# EAGLE design Europroto2 (EAGLE 9.6.2)
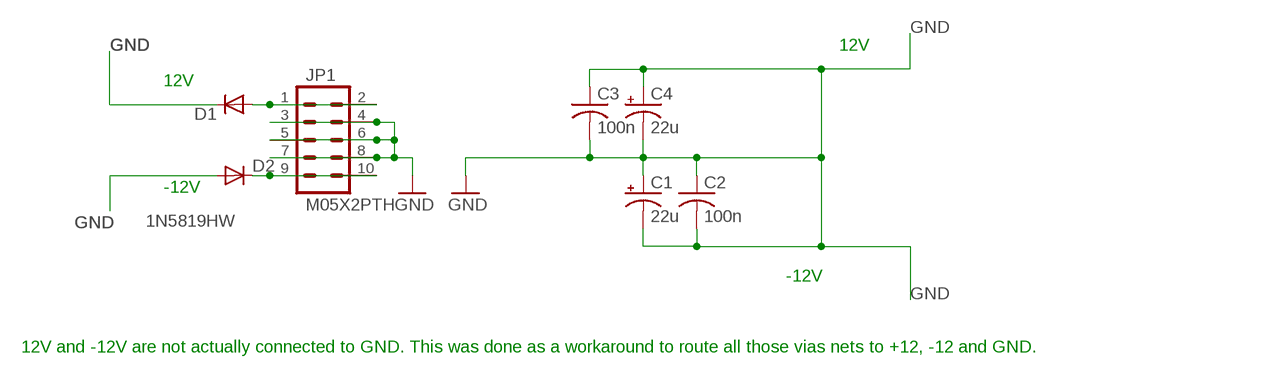
[diagram p0: schematic, sheet 1]

## Parts
C1  22u  CPOL-USB  [PANASONIC_B]
C2  100n  C-USC0603  [C0603]
C3  100n  C-USC0603  [C0603]
C4  22u  CPOL-USB  [PANASONIC_B]
D1  1N5819HW  DIODE-SOD123  [SOD123]
D2  1N5819HW  DIODE-SOD123  [SOD123]
JP1  M05X2PTH  [AVR_ICSP]

## Nets
GND [power]: C1.+ C1.- C2.1 C2.2 C3.1 C3.2 C4.+ C4.- D1.C D2.A JP1.3 JP1.4 JP1.5 JP1.6 JP1.7 JP1.8
N$6: D1.A JP1.1 JP1.2
N$20: D2.C JP1.9 JP1.10

## Notes on the sheet
- 12V
- 12V
- -12V
- -12V
- 12V and -12V are not actually connected to GND. This was done as a workaround to route all those vias nets to +12, -12 and GND.

## Library data of the parts
C1 C4 = rcl:CPOL-US: POLARIZED CAPACITOR, American symbol
C2 C3 = rcl:C-US: CAPACITOR, American symbol
D1 D2 = diode:DIODE-: DIODE
JP1 = og-header:M05X2: Header 5x2 Standard 10-pin dual row 0.1" header. Commonly used with AVR-ISP. Use with Spark Fun Electronics SKU: PRT-00778

## Net classes
1 power: width 0.178 mm, drill 0.305 mm, clearance 0.178 mm to class 0, clearance 0.178 mm

## Board
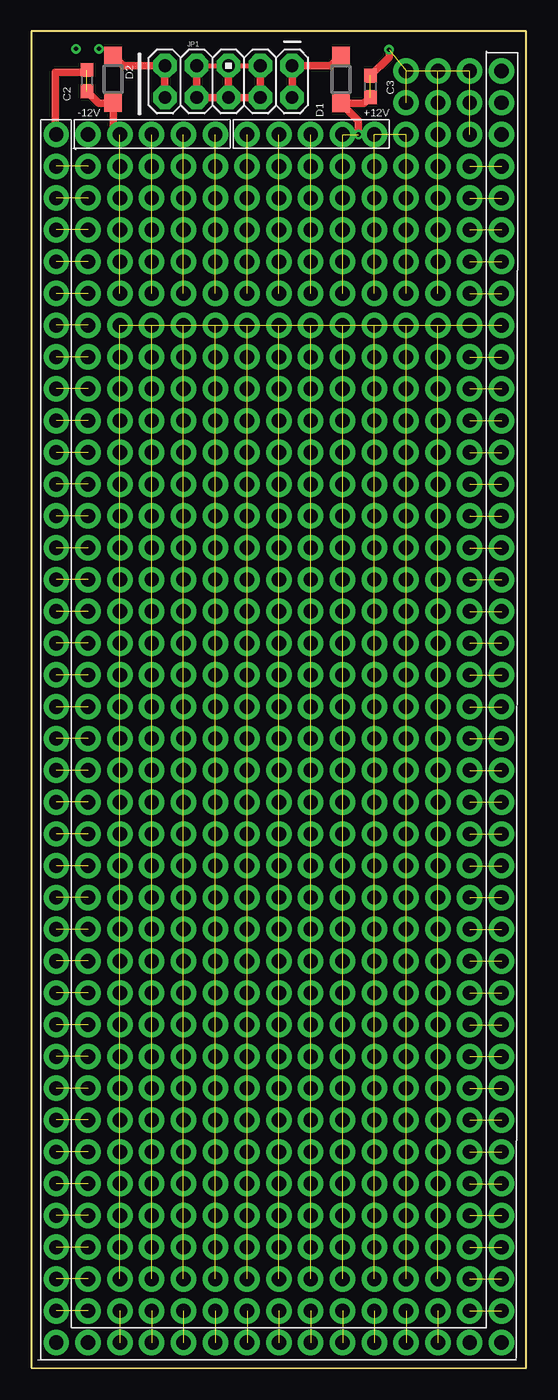
[diagram p1: board, top side]
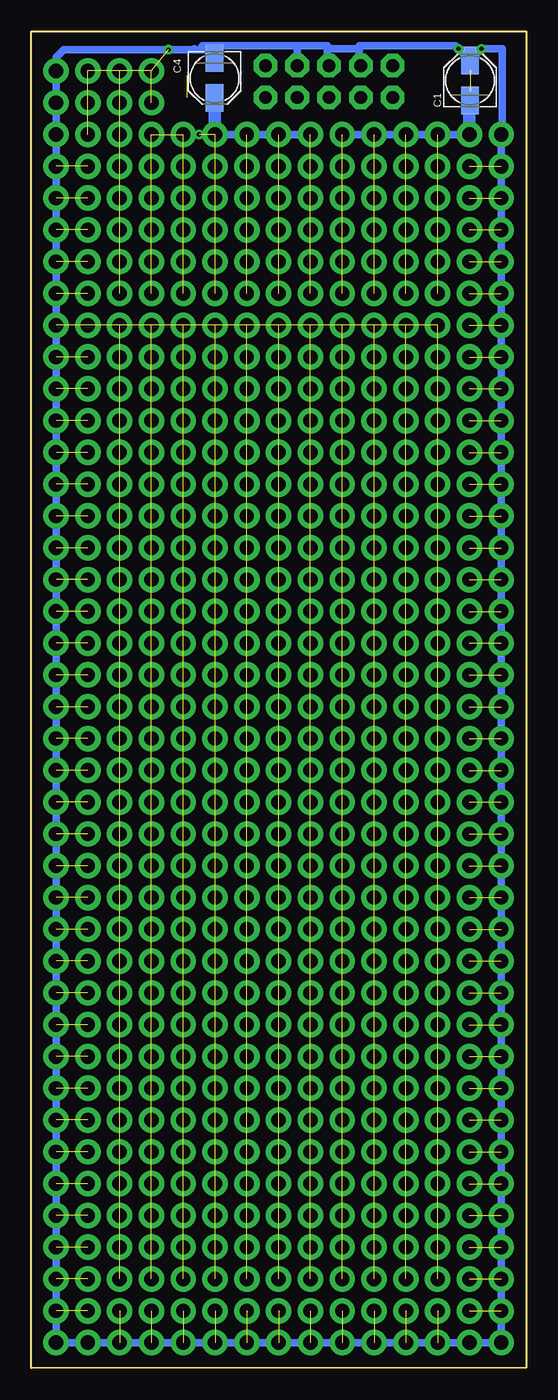
[diagram p2: board, bottom side, seen from below]

Size 39.53 x 106.81 mm. Coordinates in mm from the lower left corner, seen from the top.
Outline: 0,0.05 39.53,0 39.53,106.81 0,106.81 0,0.05
Copper layers (1*16): Top 0.035mm / dielectric 1.5mm / Bottom 0.035mm
Design rules "default": minimum track width 6mil, minimum drill 0.35mm, track to track 6mil, track to pad 6mil, pad to pad 6mil, via to via 6mil, smd to smd 6mil, copper to edge 40mil, drill to drill 6mil, minimum pad ring 10mil, minimum via ring 8mil, stop-mask expansion 4mil, vias tented up to drill 0mil, thermal gap 10mil

### Footprints (pad centres in the part's own frame; a part is rotated, then mirrored left to right if it is on the bottom)
PANASONIC_B = smd 2.2 x 1.4: + 1.6,0; - -1.6,0
C0603 = smd 1.1 x 1: 1 -0.85,0; 2 0.85,0
SOD123 = smd 1.4 x 1.4: A 1.9,0; C -1.9,0
AVR_ICSP = drill 1.016 pad 1.88 octagon: 1 -1.27,5.08; 2 1.27,5.08; 3 -1.27,2.54; 4 1.27,2.54; 5 -1.27,0; 6 1.27,0; 7 -1.27,-2.54; 8 1.27,-2.54; 9 -1.27,-5.08; 10 1.27,-5.08

### Placement (x,y rotation side)
C1  4.49,102.89 90 bottom
C2  4.44,102.87 270 top
C3  27.07,102.4 90 top
C4  24.89,103.07 270 bottom
D1  24.72,102.96 90 top
D2  6.53,102.98 270 top
JP1  15.75,102.79 270 top

### Tracks (layer width: path | path; a pad name or v marks a point on that pad's centre or on a via)
GND  (via drill 0.35, 1.14 pad 2.03)  (493 unrouted)
  Top 0.406: JP1.7 JP1.5 JP1.3 | 6.78,100.83 D2.A | D1.C 25.02,101.06
  Top 0.61: JP1.6 JP1.4 JP1.3 | JP1.6 JP1.8 JP1.7 | v28.57,105.34 28.57,104.75 C3.2 | v7.07,98.56 6.53,99.11 D2.A 5.38,101.08 C2.2 | D1.C 25.08,101.42 | C2.1 4.28,103.56 1.91,103.56 1.91,98.65 v1.99,98.56 | JP1.5 JP1.6 | C3.1 26.59,101.06 D1.C | D1.C 26.12,99.66 v26.12,98.56
  Bottom 0.178: C1.- 4.49,101.28 | C1.- 4.53,101.25 | 4.53,101.25 v4.53,98.56 4.53,101.25 | C1.- 4.53,101.25 | C1.- 4.53,101.25
  Bottom 0.406: 24.74,101.32 C4.+
  Bottom 0.61: JP1.5 15.88,104.19 15.88,105.41 | 15.88,105.41 15.88,105.67 18.5,105.67 | 15.88,105.41 13.34,105.41 | JP1.7 13.34,104.19 13.34,105.41 | 13.34,105.41 13.34,105.67 5.67,105.67 v5.41,105.41 C1.+ v3.57,105.41 1.91,105.41 1.91,98.65 v1.99,98.56 v1.99,96.02 v1.99,93.48 v1.99,90.94 v1.99,88.4 v1.99,85.86 v1.99,83.32 v1.99,80.78 v1.99,78.24 v1.99,75.7 v1.99,73.16 v1.99,70.62 v1.99,68.08 v1.99,65.54 v1.99,63 v1.99,60.46 v1.99,57.92 v1.99,55.38 v1.99,52.84 v1.99,50.3 v1.99,47.76 v1.99,45.22 v1.99,42.68 v1.99,40.14 v1.99,37.6 v1.99,35.06 v1.99,32.52 v1.99,29.98 v1.99,27.44 v1.99,24.9 v1.99,22.36 v1.99,19.82 v1.99,17.28 v1.99,14.74 v1.99,12.2 v1.99,9.66 v1.99,7.12 v1.99,4.58 v1.99,2.04 v4.53,2.04 v7.07,2.04 v9.61,2.04 v12.15,2.04 v14.69,2.04 v17.23,2.04 v19.77,2.04 v22.31,2.04 v24.85,2.04 v27.39,2.04 v29.93,2.04 v32.47,2.04 v35.01,2.04 v37.55,2.04 v37.55,4.58 v37.55,7.12 v37.55,9.66 v37.55,12.2 v37.55,14.74 v37.55,17.28 v37.55,19.82 v37.55,22.36 v37.55,24.9 v37.55,27.44 v37.55,29.98 v37.55,32.52 v37.55,35.06 v37.55,37.6 v37.55,40.14 v37.55,42.68 v37.55,45.22 v37.55,47.76 v37.55,50.3 v37.55,52.84 v37.55,55.38 v37.55,57.92 v37.55,60.46 v37.55,63 v37.55,65.54 v37.55,68.08 v37.55,70.62 v37.55,73.16 v37.55,75.7 v37.55,78.24 v37.55,80.78 v37.55,83.32 v37.55,85.86 v37.55,88.4 v37.55,90.94 v37.55,93.48 v37.55,96.02 v37.55,98.56 v37.55,101.1 v37.55,103.64 37.55,104.74 36.95,105.34 v28.57,105.34 26.45,105.34 | 18.5,105.67 18.29,105.46 JP1.3 | 18.5,105.67 25.89,105.67 C4.- 25.56,105.34 26.45,105.34 | 26.45,105.34 26.52,105.41
  Bottom 0.61: C4.+ 24.89,100.81 | 4.49,101.28 C1.- | v4.53,98.56 v7.07,98.56 v9.61,98.56 v12.15,98.56 v14.69,98.56 | v27.39,98.56 v26.12,98.56 24.77,98.56 v22.31,98.56 v19.77,98.56 v17.23,98.56
  Bottom 0.813: C1.- 4.53,101.25 | 24.89,98.69 24.77,98.56
  Bottom 1.016: C4.+ 24.89,98.69 | 4.53,101.25 v4.53,98.56
  other vias: 29.93,103.64 32.47,103.64 35.01,103.64 29.93,101.1 32.47,101.1 35.01,101.1 29.93,98.56 32.47,98.56 35.01,98.56 4.53,96.02 7.07,96.02 9.61,96.02 12.15,96.02 14.69,96.02 17.23,96.02 19.77,96.02 22.31,96.02 24.85,96.02 27.39,96.02 29.93,96.02 32.47,96.02 35.01,96.02 4.53,93.48 7.07,93.48 9.61,93.48 12.15,93.48 14.69,93.48 17.23,93.48 19.77,93.48 22.31,93.48 24.85,93.48 27.39,93.48 29.93,93.48 32.47,93.48 35.01,93.48 4.53,4.58 7.07,4.58 9.61,4.58 12.15,4.58 14.69,4.58 17.23,4.58 19.77,4.58 22.31,4.58 24.85,4.58 27.39,4.58 29.93,4.58 32.47,4.58 35.01,4.58 24.85,98.56 4.53,83.32 7.07,83.32 9.61,83.32 12.15,83.32 14.69,83.32 17.23,83.32 19.77,83.32 22.31,83.32 24.85,83.32 27.39,83.32 29.93,83.32 32.47,83.32 35.01,83.32 4.53,90.94 7.07,90.94 9.61,90.94 12.15,90.94 14.69,90.94 17.23,90.94 19.77,90.94 22.31,90.94 24.85,90.94 27.39,90.94 29.93,90.94 32.47,90.94 35.01,90.94 4.53,88.4 7.07,88.4 9.61,88.4 12.15,88.4 14.69,88.4 17.23,88.4 19.77,88.4 22.31,88.4 24.85,88.4 27.39,88.4 29.93,88.4 32.47,88.4 35.01,88.4 4.53,85.86 7.07,85.86 9.61,85.86 12.15,85.86 14.69,85.86 17.23,85.86 19.77,85.86 22.31,85.86 24.85,85.86 27.39,85.86 29.93,85.86 32.47,85.86 35.01,85.86 4.53,80.78 7.07,80.78 9.61,80.78 12.15,80.78 14.69,80.78 17.23,80.78 19.77,80.78 22.31,80.78 24.85,80.78 27.39,80.78 29.93,80.78 32.47,80.78 35.01,80.78 4.53,78.24 7.07,78.24 9.61,78.24 12.15,78.24 14.69,78.24 17.23,78.24 19.77,78.24 22.31,78.24 24.85,78.24 27.39,78.24 29.93,78.24 32.47,78.24 35.01,78.24 4.53,75.7 7.07,75.7 9.61,75.7 12.15,75.7 14.69,75.7 17.23,75.7 19.77,75.7 22.31,75.7 24.85,75.7 27.39,75.7 29.93,75.7 32.47,75.7 35.01,75.7 4.53,73.16 7.07,73.16 9.61,73.16 12.15,73.16 14.69,73.16 17.23,73.16 19.77,73.16 22.31,73.16 24.85,73.16 27.39,73.16 29.93,73.16 32.47,73.16 35.01,73.16 4.53,70.62 7.07,70.62 9.61,70.62 12.15,70.62 14.69,70.62 17.23,70.62 19.77,70.62 22.31,70.62 24.85,70.62 27.39,70.62 29.93,70.62 32.47,70.62 35.01,70.62 4.53,68.08 7.07,68.08 9.61,68.08 12.15,68.08 14.69,68.08 17.23,68.08 19.77,68.08 22.31,68.08 24.85,68.08 27.39,68.08 29.93,68.08 32.47,68.08 35.01,68.08 4.53,65.54 7.07,65.54 9.61,65.54 12.15,65.54 14.69,65.54 17.23,65.54 19.77,65.54 22.31,65.54 24.85,65.54 27.39,65.54 29.93,65.54 32.47,65.54 35.01,65.54 4.53,63 7.07,63 9.61,63 12.15,63 14.69,63 17.23,63 19.77,63 22.31,63 24.85,63 27.39,63 29.93,63 32.47,63 35.01,63 4.53,60.46 7.07,60.46 9.61,60.46 12.15,60.46 14.69,60.46 17.23,60.46 19.77,60.46 22.31,60.46 24.85,60.46 27.39,60.46 29.93,60.46 32.47,60.46 35.01,60.46 4.53,57.92 7.07,57.92 9.61,57.92 12.15,57.92 14.69,57.92 17.23,57.92 19.77,57.92 22.31,57.92 24.85,57.92 27.39,57.92 29.93,57.92 32.47,57.92 35.01,57.92 4.53,55.38 7.07,55.38 9.61,55.38 12.15,55.38 14.69,55.38 17.23,55.38 19.77,55.38 22.31,55.38 24.85,55.38 27.39,55.38 29.93,55.38 32.47,55.38 35.01,55.38 4.53,52.84 7.07,52.84 9.61,52.84 12.15,52.84 14.69,52.84 17.23,52.84 19.77,52.84 22.31,52.84 24.85,52.84 27.39,52.84 29.93,52.84 32.47,52.84 35.01,52.84 4.53,50.3 7.07,50.3 9.61,50.3 12.15,50.3 14.69,50.3 17.23,50.3 19.77,50.3 22.31,50.3 24.85,50.3 27.39,50.3 29.93,50.3 32.47,50.3 35.01,50.3 4.53,47.76 7.07,47.76 9.61,47.76 12.15,47.76 14.69,47.76 17.23,47.76 19.77,47.76 22.31,47.76 24.85,47.76 27.39,47.76 29.93,47.76 32.47,47.76 35.01,47.76 4.53,45.22 7.07,45.22 9.61,45.22 12.15,45.22 14.69,45.22 17.23,45.22 19.77,45.22 22.31,45.22 24.85,45.22 27.39,45.22 29.93,45.22 32.47,45.22 35.01,45.22 4.53,42.68 7.07,42.68 9.61,42.68 12.15,42.68 14.69,42.68 17.23,42.68 19.77,42.68 22.31,42.68 24.85,42.68 27.39,42.68 29.93,42.68 32.47,42.68 35.01,42.68 4.53,40.14 7.07,40.14 9.61,40.14 12.15,40.14 14.69,40.14 17.23,40.14 19.77,40.14 22.31,40.14 24.85,40.14 27.39,40.14 29.93,40.14 32.47,40.14 35.01,40.14 4.53,37.6 7.07,37.6 9.61,37.6 12.15,37.6 14.69,37.6 17.23,37.6 19.77,37.6 22.31,37.6 24.85,37.6 27.39,37.6 29.93,37.6 32.47,37.6 35.01,37.6 4.53,35.06 7.07,35.06 9.61,35.06 12.15,35.06 14.69,35.06 17.23,35.06 19.77,35.06 22.31,35.06 24.85,35.06 27.39,35.06 29.93,35.06 32.47,35.06 35.01,35.06 4.53,32.52 7.07,32.52 9.61,32.52 12.15,32.52 14.69,32.52 17.23,32.52 19.77,32.52 22.31,32.52 24.85,32.52 27.39,32.52 29.93,32.52 32.47,32.52 35.01,32.52 4.53,29.98 7.07,29.98 9.61,29.98 12.15,29.98 14.69,29.98 17.23,29.98 19.77,29.98 22.31,29.98 24.85,29.98 27.39,29.98 29.93,29.98 32.47,29.98 35.01,29.98 4.53,27.44 7.07,27.44 9.61,27.44 12.15,27.44 14.69,27.44 17.23,27.44 19.77,27.44 22.31,27.44 24.85,27.44 27.39,27.44 29.93,27.44 32.47,27.44 35.01,27.44 4.53,24.9 7.07,24.9 9.61,24.9 12.15,24.9 14.69,24.9 17.23,24.9 19.77,24.9 22.31,24.9 24.85,24.9 27.39,24.9 29.93,24.9 32.47,24.9 35.01,24.9 4.53,22.36 7.07,22.36 9.61,22.36 12.15,22.36 14.69,22.36 17.23,22.36 19.77,22.36 22.31,22.36 24.85,22.36 27.39,22.36 29.93,22.36 32.47,22.36 35.01,22.36 4.53,19.82 7.07,19.82 9.61,19.82 12.15,19.82 14.69,19.82 17.23,19.82 19.77,19.82 22.31,19.82 24.85,19.82 27.39,19.82 29.93,19.82 32.47,19.82 35.01,19.82 4.53,17.28 7.07,17.28 9.61,17.28 12.15,17.28 14.69,17.28 17.23,17.28 19.77,17.28 22.31,17.28 24.85,17.28 27.39,17.28 29.93,17.28 32.47,17.28 35.01,17.28 4.53,14.74 7.07,14.74 9.61,14.74 12.15,14.74 14.69,14.74 17.23,14.74 19.77,14.74 22.31,14.74 24.85,14.74 27.39,14.74 29.93,14.74 32.47,14.74 35.01,14.74 4.53,12.2 7.07,12.2 9.61,12.2 12.15,12.2 14.69,12.2 17.23,12.2 19.77,12.2 22.31,12.2 24.85,12.2 27.39,12.2 29.93,12.2 32.47,12.2 35.01,12.2 4.53,9.66 7.07,9.66 9.61,9.66 12.15,9.66 14.69,9.66 17.23,9.66 19.77,9.66 22.31,9.66 24.85,9.66 27.39,9.66 29.93,9.66 32.47,9.66 35.01,9.66 4.53,7.12 7.07,7.12 9.61,7.12 12.15,7.12 14.69,7.12 17.23,7.12 19.77,7.12 22.31,7.12 24.85,7.12 27.39,7.12 29.93,7.12 32.47,7.12 35.01,7.12
N$6
  Top 0.406: 24.43,104.57 D1.A
  Top 0.61: D1.A 23.92,104.06 JP1.1 JP1.2
N$20
  Top 0.61: D2.C 7.35,104.06 JP1.9 JP1.10

### Text on the board
tNames: -12V | +12V